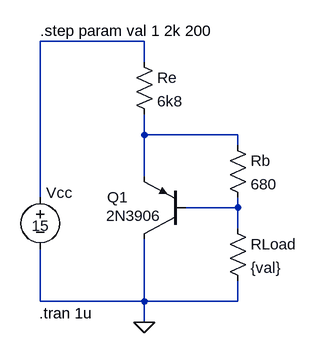
[diagram p0: schematic 1qSimpleGenCorr.asc]
1qSimpleGenCorr.asc, the LTspice schematic file:
Version 4
SHEET 1 880 680
WIRE -64 -16 -224 -16
WIRE -64 16 -64 -16
WIRE -64 128 -64 96
WIRE 80 128 -64 128
WIRE 80 144 80 128
WIRE -64 192 -64 128
WIRE -224 224 -224 -16
WIRE 80 240 80 224
WIRE 80 240 0 240
WIRE 80 272 80 240
WIRE -224 384 -224 304
WIRE -64 384 -64 288
WIRE -64 384 -224 384
WIRE 80 384 80 352
WIRE 80 384 -64 384
WIRE -64 416 -64 384
FLAG -64 416 0
SYMBOL pnp2 0 288 R180
WINDOW 0 89 64 Left 0
WINDOW 3 38 36 Left 0
SYMATTR InstName Q1
SYMATTR Value 2N3906
SYMBOL res -80 0 R0
SYMATTR InstName Re
SYMATTR Value 6k8
SYMBOL res 64 128 R0
SYMATTR InstName Rb
SYMATTR Value 680
SYMBOL voltage -224 208 R0
WINDOW 3 -13 60 Left 0
WINDOW 0 9 9 Left 0
SYMATTR Value 15
SYMATTR InstName Vcc
SYMBOL res 64 256 R0
SYMATTR InstName RLoad
SYMATTR Value {val}
TEXT -224 -32 Left 0 !.step param val 1 2k 200
TEXT -226 402 Left 0 !.tran 1u

The netlist it stands for:
* 1qSimpleGenCorr.asc
Q1 0 N003 N002 0 2N3906
Re N001 N002 6k8
Rb N002 N003 680
Vcc N001 0 15
RLoad N003 0 {val}
.model NPN NPN
.model PNP PNP
.lib standard.bjt
.step param val 1 2k 200
.tran 1u
.backanno
.end